# EAGLE design NoteRF_0.3 (EAGLE 7.3.0)
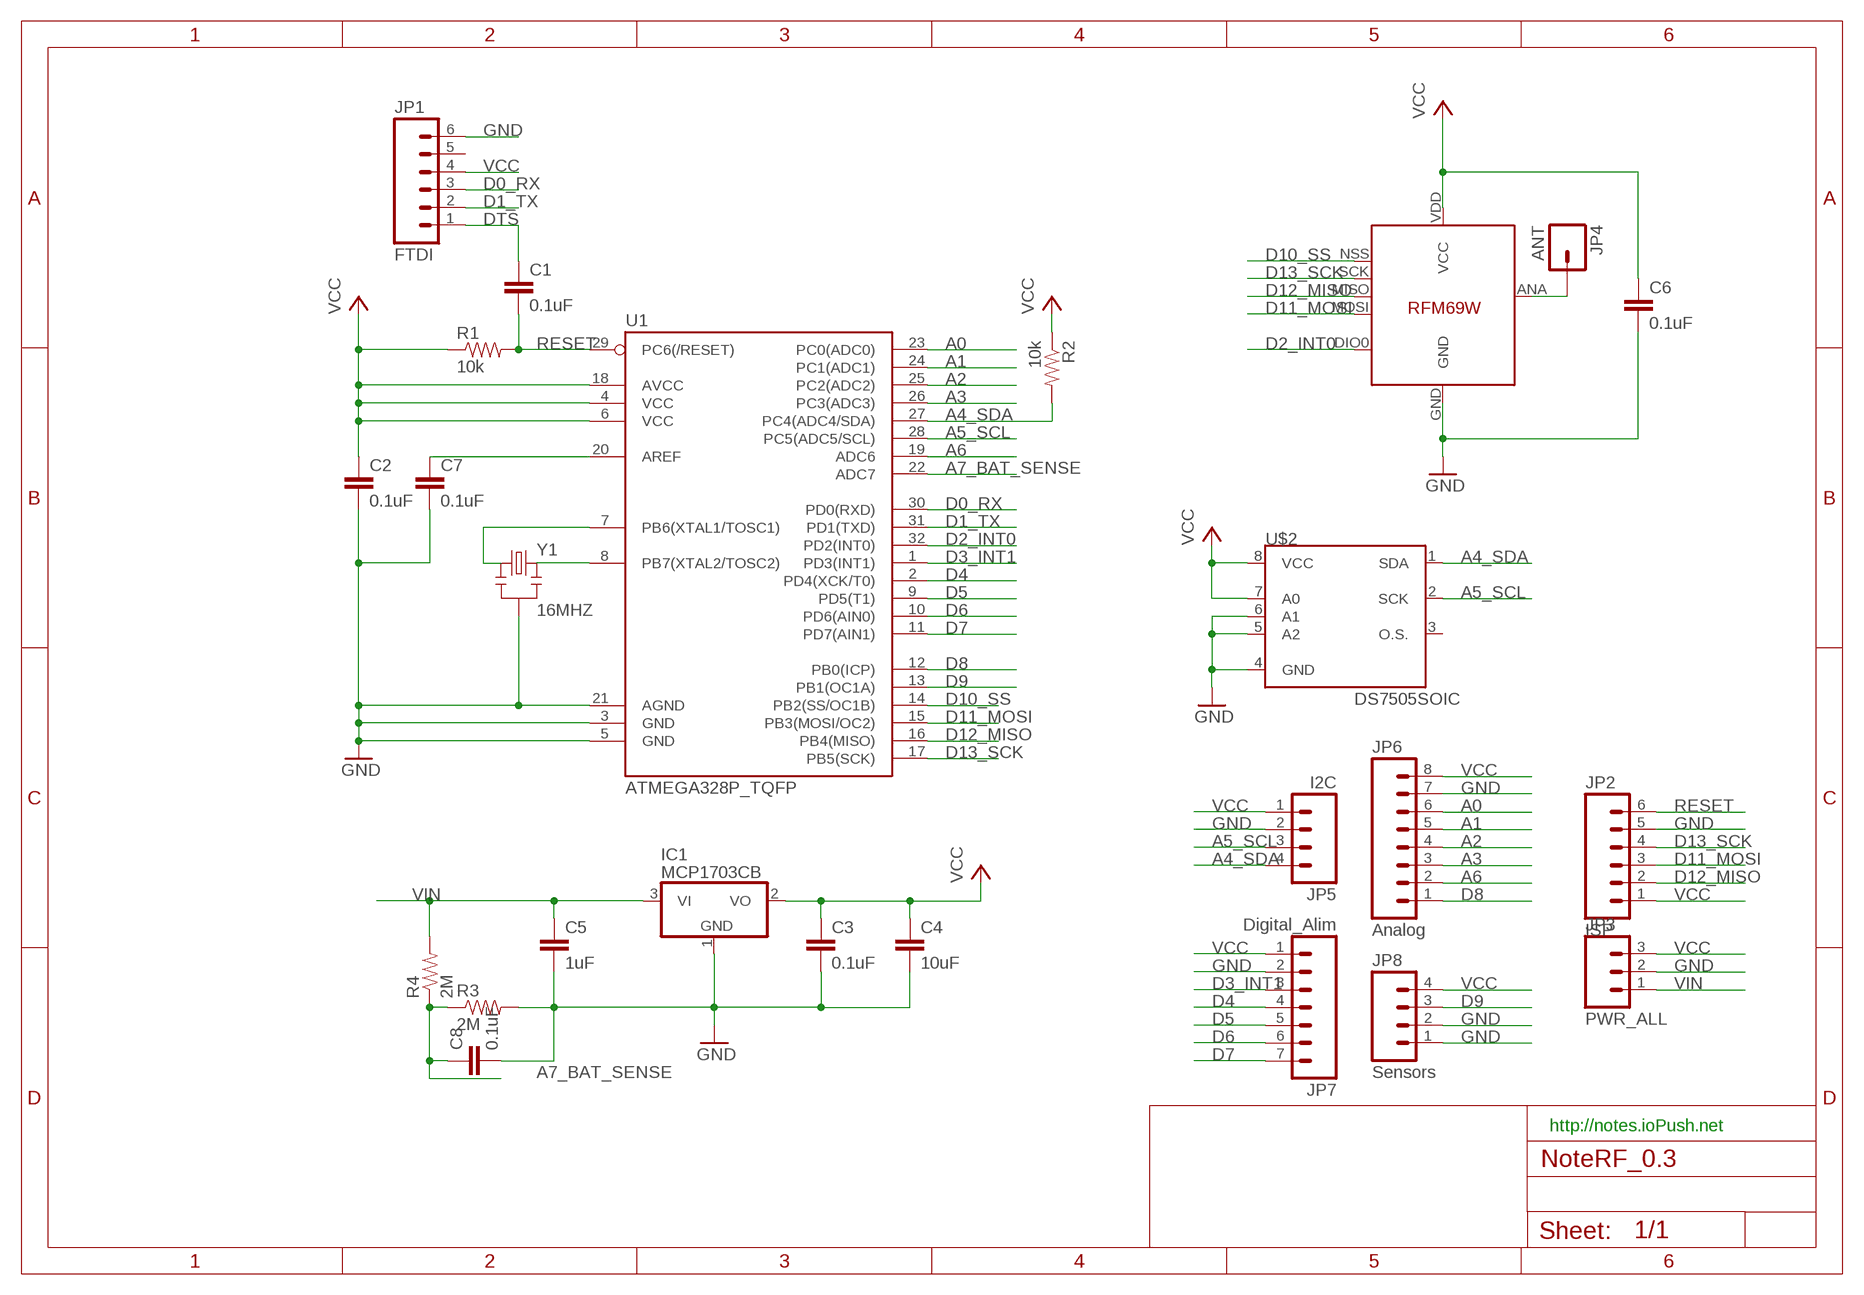
[diagram p0: schematic, sheet 1]

## Parts
C1  0.1uF  CAP0805  [0805]
C2  0.1uF  CAP0805  [0805]
C3  0.1uF  CAP0805  [0805]
C4  10uF  CAP0805  [0805]
C5  1uF  CAP0805  [0805]
C6  0.1uF  CAP0805  [0805]
C7  0.1uF  CAP0805  [0805]
C8  0.1uF  CAP0805  [0805]
IC1  MCP1703CB  [SOT23]
JP1  FTDI  M06LOCK  [1X06_LOCK]
JP2  ISP  M06LOCK  [1X06_LOCK]
JP3  PWR_ALL  M03LOCK  [1X03_LOCK]
JP4  ANT  M01NOSILK-KIT  [1X01NS-KIT]
JP5  I2C  M04LOCK  [1X04_LOCK]
JP6  Analog  M08LOCK  [1X08_LOCK]
JP7  Digital_Alim  M07LOCK  [1X07_LOCK]
JP8  Sensors  M04LOCK  [1X04_LOCK]
R1  10k  RESISTOR0805-RES  [0805]
R2  10k  RESISTOR0805-RES  [0805]
R3  2M  RESISTOR0805-RES  [0805]
R4  2M  RESISTOR0805-RES  [0805]
U1  ATMEGA328P_TQFP  [TQFP32-08]
U$1  RFM69  [RFM69W-MINPADS]
U$2  DS7505SOIC  [SO08]
Y1  16MHZ  RESONATOR16MHZ  [RESONATOR-SMD]

## Nets
A0: JP6.6 U1.23(PC0(ADC0))
A1: JP6.5 U1.24(PC1(ADC1))
A2: JP6.4 U1.25(PC2(ADC2))
A3: JP6.3 U1.26(PC3(ADC3))
A4_SDA: JP5.4 R2.2 U1.27(PC4(ADC4/SDA)) U$2.1(SDA)
A5_SCL: JP5.3 U1.28(PC5(ADC5/SCL)) U$2.2(SCK)
A6: JP6.2 U1.19(ADC6)
A7_BAT_SENSE: C8.1 R3.1 R4.1 U1.22(ADC7)
D0_RX: JP1.3 U1.30(PD0(RXD))
D1_TX: JP1.2 U1.31(PD1(TXD))
D2_INT0: U1.32(PD2(INT0)) U$1.DIO0
D3_INT1: JP7.3 U1.1(PD3(INT1))
D4: JP7.4 U1.2(PD4(XCK/T0))
D5: JP7.5 U1.9(PD5(T1))
D6: JP7.6 U1.10(PD6(AIN0))
D7: JP7.7 U1.11(PD7(AIN1))
D8: JP6.1 U1.12(PB0(ICP))
D9: JP8.3 U1.13(PB1(OC1A))
D10_SS: U1.14(PB2(SS/OC1B)) U$1.NSS(SEL)
D11_MOSI: JP2.3 U1.15(PB3(MOSI/OC2)) U$1.MOSI
D12_MISO: JP2.2 U1.16(PB4(MISO)) U$1.MISO
D13_SCK: JP2.4 U1.17(PB5(SCK)) U$1.SCK
DTS: C1.1 JP1.1
GND: C2.2 C3.2 C4.2 C5.2 C6.2 C7.2 C8.2 IC1.1(GND) JP1.6 JP2.5 JP3.2 JP5.2 JP6.7 JP7.2 JP8.1 JP8.2 R3.2 U1.3(GND) U1.5(GND) U1.21(AGND) U$1.GND U$2.4(GND) U$2.5(A2) U$2.6(A1) Y1.2
N$1: JP4.1 U$1.ANA(ANT)
N$3: C7.1 U1.20(AREF)
N$7: U1.8(PB7(XTAL2/TOSC2)) Y1.3
N$8: U1.7(PB6(XTAL1/TOSC1)) Y1.1
RESET: C1.2 JP2.6 R1.2 U1.29(PC6(/RESET))
VCC: C2.1 C3.1 C4.1 C6.1 IC1.2(VO) JP1.4 JP2.1 JP3.3 JP5.1 JP6.8 JP7.1 JP8.4 R1.1 R2.1 U1.4(VCC) U1.6(VCC) U1.18(AVCC) U$1.VDD(VCC) U$2.7(A0) U$2.8(VCC)
VIN: C5.1 IC1.3(VI) JP3.1 R4.2
Unconnected: JP1.5 U$2.3(O.S.)

## Notes on the sheet
- http://notes.ioPush.net

## Library data of the parts
C1-C8 = SparkFun-Passives:CAP: Capacitor Standard 0603 ceramic capacitor, and 0.1" leaded capacitor.
IC1 = linear:MCP1703: 250 mA, 16V, Low Quiescent Current LDO Regulator Source: http://ww1.microchip.com/downloads/en/DeviceDoc/22049b.pdf
JP1 JP2 = SparkFun-Connectors:M06: Header 6 Standard 6-pin 0.1" header. Use with straight break away headers (SKU : PRT-00116), right angle break away headers (PRT-00553), swiss pins (PRT-00743), machine pins (PRT-00117), and female headers (PRT-00115). Molex polarized connector foot print use with SKU : PRT-08094 with associated crimp pins and housings. NOTES ON THE VARIANTS LOCK and LOCK_LONGPADS... This footprint was designed to help hold the alignment of a through-hole component (i.e. 6-pin header) while soldering it into place. You may notice that each hole has been shifted either up or down by 0.005 of an inch from it's more standard position (which is a perfectly straight line). This slight alteration caused the pins (the squares in the middle) to touch the edges of the holes. Because they are alternating, it causes a "brace" to hold the component in place. 0.005 has proven to be the perfect amount of "off-center" position when using our standard breakaway headers. Although looks a little odd when you look at the bare footprint, once you have a header in there, the alteration is very hard to notice. Also,if you push a header all the way into place, it is covered up entirely on the bottom side. This idea of altering the position of holes to aid alignment will be further integrated into the Sparkfun Library for other footprints. It can help hold any component with 3 or more connection pins.
JP3 = SparkFun-Connectors:M03: Header 3 Standard 3-pin 0.1" header. Use with straight break away headers (SKU : PRT-00116), right angle break away headers (PRT-00553), swiss pins (PRT-00743), machine pins (PRT-00117), and female headers (PRT-00115). Molex polarized connector foot print use with SKU : PRT-08232 with associated crimp pins and housings.
JP4 = SparkFun-Connectors:M01: Header 1 Standard 1-pin 0.1" header. Use with straight break away headers (SKU : PRT-00116), right angle break away headers (PRT-00553), swiss pins (PRT-00743), machine pins (PRT-00117), and female headers (PRT-00115).
JP5 JP8 = SparkFun-Connectors:M04: Header 4 Standard 4-pin 0.1" header. Use with straight break away headers (SKU : PRT-00116), right angle break away headers (PRT-00553), swiss pins (PRT-00743), machine pins (PRT-00117), and female headers (PRT-00115). Molex polarized connector foot print use with SKU : PRT-08231 with associated crimp pins and housings. 1MM SMD Version SKU: PRT-10208
JP6 = SparkFun-Connectors:M08: Header 8 Standard 8-pin 0.1" header. Use with straight break away headers (SKU : PRT-00116), right angle break away headers (PRT-00553), swiss pins (PRT-00743), machine pins (PRT-00117), and female headers (PRT-00115).
JP7 = SparkFun-Connectors:M07: Header 7 Standard 7-pin 0.1" header. Use with straight break away headers (SKU : PRT-00116), right angle break away headers (PRT-00553), swiss pins (PRT-00743), machine pins (PRT-00117), and female headers (PRT-00115). NOTES ON THE VARIANTS LOCK and LOCK_LONGPADS... This footprint was designed to help hold the alignment of a through-hole component (i.e. 7-pin header) while soldering it into place. You may notice that each hole has been shifted either up or down by 0.005 of an inch from it's more standard position (which is usually a perfectly straight line). This slight alteration caused the pins (the squares in the middle) to touch the edges of the holes. Because they are alternating, it causes a "brace" to hold the header in place. 0.005 has proven to be the perfect amount of "off-center" position when using our standard breakaway headers. Although looks a little odd when you look at the bare footprint, once you have a header in there, the alteration is very hard to notice. Also, if you push a header all the way into place, it is covered up entirely on the bottom side. This idea of altering the position of holes to aid alignment will be further integrated into the Sparkfun Library for other footprints. It can help hold any component with 3 or more connection pins.
R1-R4 = SparkFun-Passives:RESISTOR: Resistor Basic schematic elements and footprints for 0603, 1206, and PTH resistors.
U1 = SparkFun-DigitalIC:ATMEGA328P_TQFP; PROD_ID: IC-09069
U$1 = LowPowerLab:RFM69
U$2 = Perso:DS7505: DS7505 temperature sensor from Maxim
Y1 = SparkFun-FreqCtrl:RESONATOR: Resonator Small SMD resonator. Used, eg, on the Arduino Pro/ Pro Mini boards. 8MHz- XTAL-08895 16MHz- XTAL-08900; PROD_ID: XTAL-08900

## Board
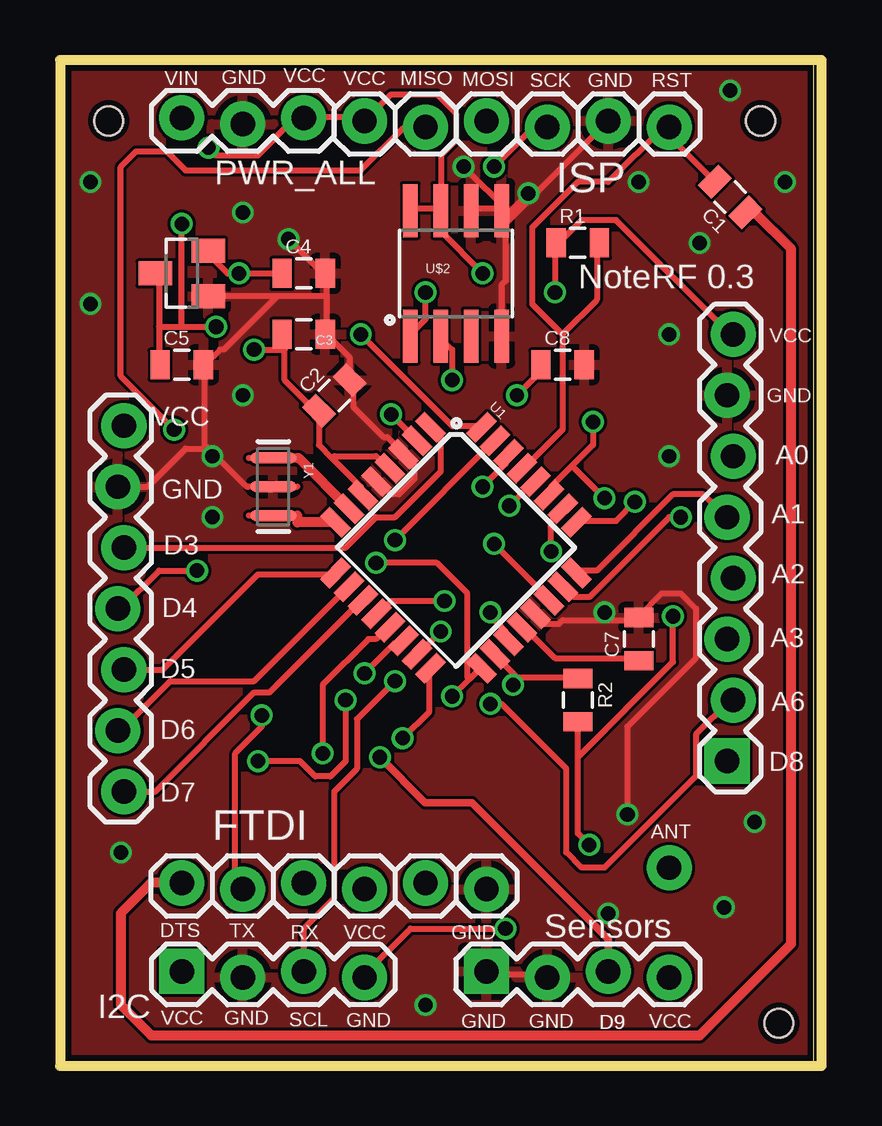
[diagram p1: board, top side]
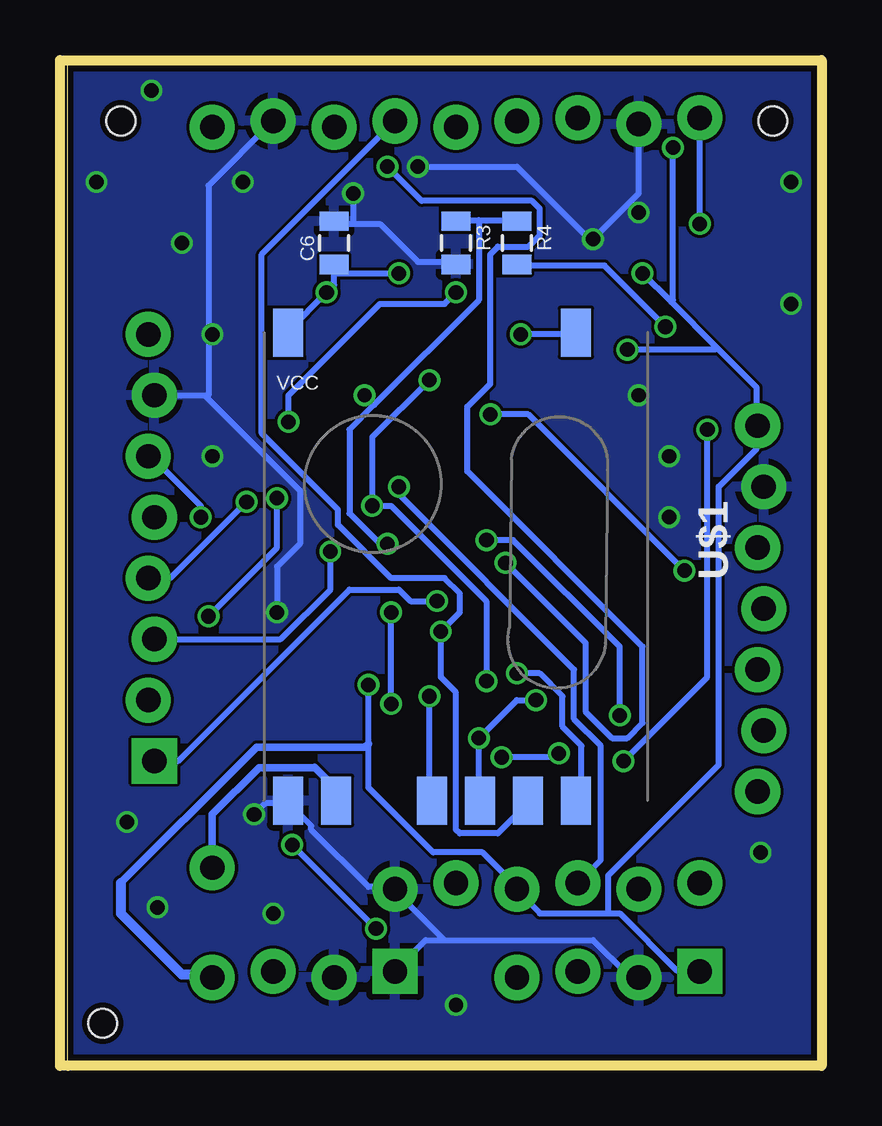
[diagram p2: board, bottom side, seen from below]

Size 31.75 x 41.91 mm. Coordinates in mm from the lower left corner, seen from the top.
Outline: 31.42,0 31.42,41.9 0,41.9
Outline: 31.42,0 0,0 0,41.9
Outline: 31.42,0 31.75,0 31.75,41.91 0,41.91 0,41.9
Copper layers (1*16): Top 0.035mm / dielectric 1.5mm / Bottom 0.035mm
Design rules "DirtyPCB": minimum track width 5mil, minimum drill 12mil, track to track 5mil, track to pad 5mil, pad to pad 5mil, via to via 5mil, smd to smd 0mil, copper to edge 10mil, drill to drill 10mil, minimum pad ring 10mil, minimum via ring 6mil, stop-mask expansion 2mil, vias tented up to drill 25mil, thermal gap 10mil
Holes 1.2 mm at 29.21,39.37 2.03,39.37 29.97,1.78

### Footprints (pad centres in the part's own frame; a part is rotated, then mirrored left to right if it is on the bottom)
0805 = smd 0.8 x 1.2: 1 -0.9,0; 2 0.9,0
SOT23 = smd 1 x 1.4: 1 -0.95,-1.1; 2 0.95,-1.1; 3 0,1.1
1X06_LOCK = drill 1.016 pad 1.88: 1 0,0; 2 2.54,-0.254; 3 5.08,0; 4 7.62,-0.254; 5 10.16,0; 6 12.7,-0.254
1X03_LOCK = drill 1.016 pad 1.88: 1 0,0.127; 2 2.54,-0.127; 3 5.08,0.127
1X01NS-KIT = drill 1.016 pad 1.88: 1 0,0
1X04_LOCK = drill 1.016 pad 1.88 square: 1 0,0.127 | drill 1.016 pad 1.88: 2 2.54,-0.127; 3 5.08,0.127; 4 7.62,-0.127
1X08_LOCK = drill 1.016 pad 1.88 square: 1 0,0.127 | drill 1.016 pad 1.88: 2 2.54,-0.127; 3 5.08,0.127; 4 7.62,-0.127; 5 10.16,0.127; 6 12.7,-0.127; 7 15.24,0.127; 8 17.78,-0.127
1X07_LOCK = drill 1.016 pad 1.88: 1 0,0.127; 2 2.54,-0.127; 3 5.08,0.127; 4 7.62,-0.127; 5 10.16,0.127; 6 12.7,-0.127; 7 15.24,0.127
TQFP32-08 = smd 1.27 x 0.559: 1 -4.293,2.8; 2 -4.293,2; 3 -4.293,1.2; 4 -4.293,0.4; 5 -4.293,-0.4; 6 -4.293,-1.2; 7 -4.293,-2; 8 -4.293,-2.8; 17 4.293,-2.8; 18 4.293,-2; 19 4.293,-1.2; 20 4.293,-0.4; 21 4.293,0.4; 22 4.293,1.2; 23 4.293,2; 24 4.293,2.8 | smd 0.559 x 1.27: 9 -2.8,-4.293; 10 -2,-4.293; 11 -1.2,-4.293; 12 -0.4,-4.293; 13 0.4,-4.293; 14 1.2,-4.293; 15 2,-4.293; 16 2.8,-4.293; 25 2.8,4.293; 26 2,4.293; 27 1.2,4.293; 28 0.4,4.293; 29 -0.4,4.293; 30 -1.2,4.293; 31 -2,4.293; 32 -2.8,4.293
RFM69W-MINPADS = smd 2 x 1.27: ANA 8,-5; DIO0 -11.5,5; GND 8,-7; MISO 8,1; MOSI 8,3; NSS 8,5; SCK 8,-1; VDD -11.5,-7
SO08 = smd 0.61 x 2.21: 1 -1.905,-2.616; 2 -0.635,-2.616; 3 0.635,-2.616; 4 1.905,-2.616; 5 1.905,2.616; 6 0.635,2.616; 7 -0.635,2.616; 8 -1.905,2.616
RESONATOR-SMD = smd 0.45 x 1.905: 1 -1.2,0; 2 0,0; 3 1.2,0

### Placement (x,y rotation side)
C1  27.94,36.2 135 top
C2  11.43,27.94 45 top
C3  10.16,30.48 0 top
C4  10.16,33.02 0 top
C5  5.08,29.21 0 top
C6  20.32,34.29 90 bottom
C7  24.13,17.78 90 top
C8  20.95,29.21 0 top
IC1  5.08,33.02 90 top
JP1  5.08,7.62 0 top
JP2  12.7,39.37 0 top
JP3  5.08,39.37 0 top
JP4  25.4,8.26 0 top
JP5  5.08,3.81 0 top
JP6  27.94,12.7 90 top
JP7  2.54,26.67 270 top
JP8  17.78,3.81 0 top
R1  21.59,34.29 0 top
R2  21.59,15.24 270 top
R3  15.24,34.29 270 bottom
R4  12.7,34.29 270 bottom
U1  16.51,21.59 315 top
U$1  15.24,19.05 270 bottom
U$2  16.51,33.02 0 top
Y1  8.89,24.13 270 top

### Tracks (layer width: path | path; a pad name or v marks a point on that pad's centre or on a via)
A0  (via drill 0.61)
  Top 0.254: v25.88,22.86 25.4,22.86 22.07,19.53 21.43,19.53 21.11,19.84 U1.23
  Bottom 0.254: v25.88,22.86 25.88,23.34 27.94,25.4 JP6.6
A1
  Top 0.254: U1.24 21.59,20.64 22.38,20.64 25.56,23.81 26.83,23.81 27.78,22.86 JP6.5
A2  (via drill 0.61)
  Top 0.254: v23.97,23.5 23.18,22.7 21.59,22.7 U1.25
  Bottom 0.254: v23.97,23.5 27.15,20.32 JP6.4
A3  (via drill 0.61)
  Top 0.254: v20.48,21.43 20.48,22.7 20.95,23.18 U1.26
  Bottom 0.254: v20.48,21.43 20.48,19.84 22.54,17.78 JP6.3
A4_SDA  (via drill 0.61)
  Top 0.254: 21.35,25 22.23,25.88 v22.23,26.83 | 21.35,25 20.48,24.13 20.48,23.81 U1.27 | v15.24,32.23 15.24,31.11 14.61,30.48 U$2.1 | 21.59,12.86 21.59,9.68 v22.07,9.21 | 21.59,12.86 R2.2 | v18.57,5.71 14.61,5.71 12.7,3.81 JP5.4 | v22.7,23.65 21.35,25 | v25.56,18.73 25.56,16.83 21.59,12.86
  Bottom 0.254: v18.57,5.71 v22.07,9.21 | v22.7,23.65 22.7,21.59 v25.56,18.73 | v22.23,26.83 22.23,27.94 18.41,31.75 15.72,31.75 v15.24,32.23
A5_SCL  (via drill 0.61)
  Top 0.254: v18.73,23.34 19.68,24.29 U1.28 | v16.35,28.57 16.35,29.84 15.88,30.32 U$2.2 | JP5.3 10.16,5.71 11.43,6.99 11.43,11.43 12.38,12.38 12.38,14.45 v13.97,16.03
  Bottom 0.254: v16.35,28.57 18.73,26.19 v18.73,23.34 17.94,23.34 13.97,19.37 v13.97,16.03
A6  (via drill 0.61)
  Top 0.254: JP6.2 27.94,15.24 26.51,13.81 26.51,12.06 22.7,8.26 21.75,8.26 21.11,8.89 21.11,12.38 19.05,14.45 18.41,15.08 v17.94,15.08 | v17.94,18.89 17.94,18.73 18.57,18.1 18.57,17.78 U1.19
  Bottom 0.254: v17.94,15.08 v17.94,18.89
A7_BAT_SENSE  (via drill 0.6, 0.61)
  Top 0.254: v18.1,21.75 20.32,19.53 U1.22 | C8.1 20.05,28.95 v19.05,27.94
  Bottom 0.254: 14.29,35.24 15.24,35.24 R3.1 | 14.29,35.24 12.7,35.24 R4.1 | v18.1,21.75 18.41,21.75 19.68,23.02 19.68,26.51 18.65,27.54 | 18.65,27.54 14.29,31.91 14.29,35.24 | v19.05,27.94 18.65,27.54
D0_RX  (via drill 0.61)
  Top 0.254: v17.62,24.13 18.57,25.08 18.57,25.4 U1.30
  Bottom 0.254: v17.62,24.13 17.62,23.81 10.32,16.51 10.32,14.45 9.21,13.34 9.21,8.57 JP1.3
D1_TX  (via drill 0.61)
  Top 0.254: v13.97,21.91 18.1,26.04 U1.31 | v8.41,14.61 8.41,14.13 7.3,13.02 7.3,7.78 7.62,7.46 JP1.2
  Bottom 0.254: v13.97,21.91 12.86,21.91 8.41,17.46 v8.41,14.61
D2_INT0  (via drill 0.61)
  Top 0.254: v12.54,30.48 16.35,26.67 17.46,26.67 U1.32
  Bottom 0.254: v12.54,30.48 10.32,30.48 U$1.DIO0
D3_INT1
  Top 0.254: JP7.3 11.91,21.59 13.18,22.86 13.97,22.86 15.88,24.77 15.88,26.19 15.56,26.51 U1.1
D4  (via drill 0.61)
  Top 0.254: v13.81,27.15 14.76,26.19 U1.2 | v5.71,20.64 4.13,20.64 2.54,19.05 JP7.4
  Bottom 0.254: v13.81,27.15 12.22,27.15 v5.71,20.64
D5
  Top 0.254: JP7.5 4.29,16.51 8.26,20.48 11.43,20.48 U1.9
D6
  Top 0.254: U1.10 11.91,19.84 8.1,16.03 4.6,16.03 2.54,13.97 JP7.6
D7
  Top 0.254: JP7.7 3.97,11.43 8.1,15.56 8.73,15.56 12.54,19.37 U1.11
D8  (via drill 0.61)
  Top 0.254: v16.03,19.37 13.81,19.37 13.34,18.89 U1.12
  Bottom 0.254: v16.03,19.37 17.14,19.37 17.62,19.84 19.68,19.84 26.83,12.7 JP6.1
D9  (via drill 0.61)
  Top 0.254: v13.34,12.86 13.49,12.7 | v10.95,13.02 10.95,15.88 12.86,17.78 13.18,17.78 13.65,18.26 U1.13
  Top 0.305: JP8.3 22.86,5.28 17.17,10.97 15.22,10.97 v13.34,12.86
  Bottom 0.254: v13.34,12.86 11.11,12.86 v10.95,13.02
D10_SS  (via drill 0.61)
  Top 0.254: v12.7,16.35 13.97,17.62 14.29,17.62 U1.14
  Bottom 0.254: v12.7,16.35 11.75,16.35 10.79,15.4 10.79,14.13 10,13.34 10,11.27 10.16,11.11 U$1.NSS
D11_MOSI  (via drill 0.61)
  Top 0.254: v15.88,18.1 14.92,17.14 U1.15
  Bottom 0.254: U$1.MOSI 12.22,10.95 13.49,9.68 15.08,9.68 15.24,9.84 15.24,15.56 15.88,16.19 v15.88,18.1 15.08,18.89 15.08,19.68 15.72,20.32 17.94,20.32 20.16,22.54 20.16,23.18 23.34,26.35 23.34,33.81 JP2.3
D12_MISO  (via drill 0.61)
  Top 0.254: v14.29,13.65 15.4,14.76 15.4,16.51 U1.16 | v4.76,26.51 2.54,28.73 2.54,37.47 3.17,38.1 4.45,38.1 5.24,37.31 12.54,37.31 14.29,39.05 15.24,39.05 JP2.2 | v8.26,12.7 10,12.7 10.64,12.06 11.27,12.06 11.91,12.7 v11.91,15.24
  Bottom 0.254: U$1.MISO 14.29,11.11 v14.29,13.65 12.7,15.24 v11.91,15.24 | v4.76,26.51 4.76,16.19 v8.26,12.7
D13_SCK  (via drill 0.61)
  Top 0.254: v16.35,15.4 17.07,16.11 | 17.07,16.11 17.46,16.51 U1.17 | v18.1,37.47 19.68,39.05 20.32,39.05 JP2.4 | v13.18,20.95 15.72,20.95 16.99,19.68 16.99,16.19 17.07,16.11
  Bottom 0.254: v16.35,15.4 16.35,11.11 U$1.SCK | v18.1,37.47 16.67,36.04 12.06,36.04 11.75,35.72 11.75,34.61 12.22,34.13 13.49,34.13 13.81,33.81 13.81,28.42 14.76,27.46 14.76,24.77 7.46,17.46 7.46,14.29 8.1,13.65 8.73,13.65 9.84,14.76 9.84,17.62 v13.18,20.95
DTS
  Top 0.406: JP1.1 3.81,7.62 2.54,6.35 2.54,2.54 3.81,1.27 26.67,1.27 30.48,5.08 30.48,34.04 28.96,35.56 C1.1
GND  (via drill 0.6, 0.61)
  Top 0.254: 6.03,29.21 6.03,25.88 6.11,25.8 | 6.11,25.8 7.78,24.13 7.87,24.13 | JP7.2 3.65,24.13 5.24,25.72 6.03,25.72 6.11,25.8 | U1.5 13.34,24.29 13.81,23.81 14.13,23.81 14.76,24.45 14.76,25.08 14.45,25.4 U1.3 14.29,25.56 13.65,26.19 13.49,26.19 12.22,27.46 12.22,28.57 C2.2 12.06,28.73 12.06,29.53 11.11,30.48 | 11.11,32.07 11.11,33.02 C4.2 10.95,33.02 v9.53,34.45 | 11.11,32.07 11.11,30.48 | 11.11,30.48 C3.2 | 11.11,32.07 9.05,32.07 | 9.05,32.07 IC1.1 | 6.03,29.21 6.67,29.84 6.83,29.84 9.05,32.07 | 6.03,29.21 C5.2 | JP8.2 20.32,3.81 17.78,3.81 JP8.1 | 22.7,18.57 20.95,18.57 20.8,18.41 20.16,18.41 19.84,18.73 U1.21 | 22.7,18.57 24.13,18.57 C7.2 24.13,18.73 25.08,19.68 25.88,19.68 26.51,19.05 26.51,16.99 23.65,14.13 v23.65,10.48 | v22.7,18.89 22.7,18.57 | U$2.4 18.41,32.54 18.57,32.7 18.57,35.08 | 18.57,35.4 18.57,35.08 | 18.57,35.4 18.41,35.56 U$2.5 | U$2.6 17.14,35.72 18.41,35.72 U$2.5 | 18.57,35.4 18.73,35.56 | 18.73,35.56 v19.53,36.35 | 18.57,35.4 U$2.5 | 18.57,35.08 JP2.5 | 18.57,35.08 U$2.5 | 18.73,35.56 v16.83,37.47
  Bottom 0.254: JP3.2 7.62,36.35 v9.53,34.45 9.53,34.61 9.84,34.61 12.7,37.47 v16.83,37.47 | 15.72,5.24 16.51,5.24 17.78,3.97 JP8.1 | 15.72,5.24 9.53,5.24 8.1,3.81 7.62,3.81 JP5.2 | 15.72,5.24 17.78,7.3 JP1.6 17.78,7.46 18.89,7.46 21.27,9.84 21.27,10 22.23,10.95 U$1.GND 22.38,10.95 23.18,10.95 v23.65,10.48 | v22.7,18.89 22.7,20.8 21.75,21.75 21.75,23.97 25.64,27.86 | 25.64,27.86 25.72,27.94 JP6.7 | 19.53,35.08 20.32,35.08 C6.2 | 19.53,35.08 18.41,35.08 16.83,33.5 15.24,33.5 R3.2 | v19.53,36.35 19.53,35.08 | JP2.5 25.56,36.67 25.56,27.94 25.64,27.86
  other vias: 2.54,8.89 15.24,2.54 22.86,6.35 28.96,10.16 7.62,27.94 6.35,25.4 6.35,22.86 7.62,35.56 25.4,30.48 26.67,34.29 25.4,25.4 1.27,36.83 1.27,31.75 24.13,36.83 27.94,40.64 30.23,36.83 27.69,6.6
  pour Bottom: 0,0 31.75,0 31.75,41.91 0,41.91
  pour Top: 31.75,0 31.75,41.91 0,41.91 0,0
N$1
  Bottom 0.305: U$1.ANA 20.24,11.54 21.14,12.45 21.18,12.42 23.46,12.42 25.4,10.48 JP4.1
N$3
  Top 0.254: C7.1 24.13,16.99 20.64,16.99 19.37,18.26 U1.20
N$7
  Top 0.406: U1.8 9.91,22.64 9.91,22.93
N$8
  Top 0.406: 9.91,25.33 9.94,25.33 U1.7
RESET
  Top 0.254: R1.2 22.38,34.29 22.38,31.91 20.95,30.48 | U1.29 19.37,24.92 20.95,26.51 20.95,30.48 | C1.2 25.4,38.73 JP2.6 25.15,39.12 22.86,36.83 21.59,36.83 19.68,34.92 19.68,31.75 20.95,30.48
VCC  (via drill 0.61)
  Top 0.254: 15.88,35.72 14.61,35.72 U$2.8 | 15.88,35.72 15.88,37.94 16.51,38.58 16.51,39.69 15.72,40.48 13.81,40.48 JP2.1 12.7,39.53 10.16,39.53 JP3.3 10.16,39.37 9.68,39.37 8.26,37.94 6.51,37.94 v6.19,38.26 | 15.88,35.72 U$2.7 15.88,34.77 v17.62,33.02 | JP6.8 27.94,30.48 23.18,35.24 21.75,35.24 20.8,34.29 R1.1 20.64,34.29 v20.64,32.23 | 9.37,29.84 9.37,28.57 10.64,27.3 C2.1 10.79,27.15 10.79,25.88 11.35,25.32 | 9.37,29.84 9.37,30.48 C3.1 | 11.35,25.32 12.54,24.13 12.54,23.81 U1.6 | U1.4 13.65,24.92 13.18,25.4 11.43,25.4 11.35,25.32 | C4.1 v7.46,33.02 6.99,33.02 6.19,33.81 IC1.2 | v8.1,29.84 9.37,29.84 | 18.97,16.27 18.26,16.99 U1.18 | 18.97,16.27 19.05,16.19 21.59,16.19 R2.1 | v18.89,15.88 18.89,16.19 18.97,16.27
  Bottom 0.254: 20.32,33.02 20.32,32.54 v20.64,32.23 22.23,30.64 U$1.VDD | 20.32,33.02 C6.1 20.32,33.34 | 20.32,33.02 v17.62,33.02 | 4.37,29.92 2.7,28.26 2.7,26.67 | 4.37,29.92 6.27,31.83 | 6.27,31.83 v7.46,33.02 | v8.1,29.84 4.45,29.84 4.37,29.92 | v18.89,15.88 18.89,13.43 18.89,11.59 16.19,8.89 14.13,8.89 12.7,7.46 JP1.4 12.7,7.3 11.75,6.35 8.89,6.35 | 8.89,6.35 8.41,6.35 6.03,3.97 5.08,3.97 JP5.1 | 2.7,26.67 2.7,25.72 4.29,24.13 4.29,12.54 8.89,7.94 8.89,6.35 | 2.7,26.67 JP7.1 | v6.19,38.26 6.19,31.91 6.27,31.83
  Bottom 0.305: 29.21,7.62 23.97,12.86 23.96,12.86 23.55,13.27 19.05,13.27 18.89,13.43
  Bottom 0.406: 29.21,7.62 29.21,6.35 26.67,3.81 25.53,3.81 JP8.4
VIN  (via drill 0.61)
  Top 0.254: 4.13,30.8 4.13,33.02 IC1.3 | 4.13,30.8 4.13,29.21 C5.1 | 4.13,30.8 5.08,30.8 | 5.08,30.8 v6.51,30.8 | 5.08,30.8 v5.08,35.08
  Bottom 0.254: v6.51,30.8 9.05,33.34 12.7,33.34 R4.2 | v5.08,35.08 JP3.1

### Text on the board
tNames: VIN | GND | VCC | VCC | MISO | MOSI | SCK | GND | RST | NoteRF 0.3 | VCC | GND | VCC | A0 | GND | A1 | D3 | A2 | D4 | A3 | D5 | A6 | D6 | D8 | D7 | ANT | DTS | TX | RX | VCC | GND | Sensors | I2C | VCC | GND | SCL | GND | GND | GND | D9 | D9 | VCC
bNames: VCC